# EAGLE design charger (EAGLE 6.5.0)
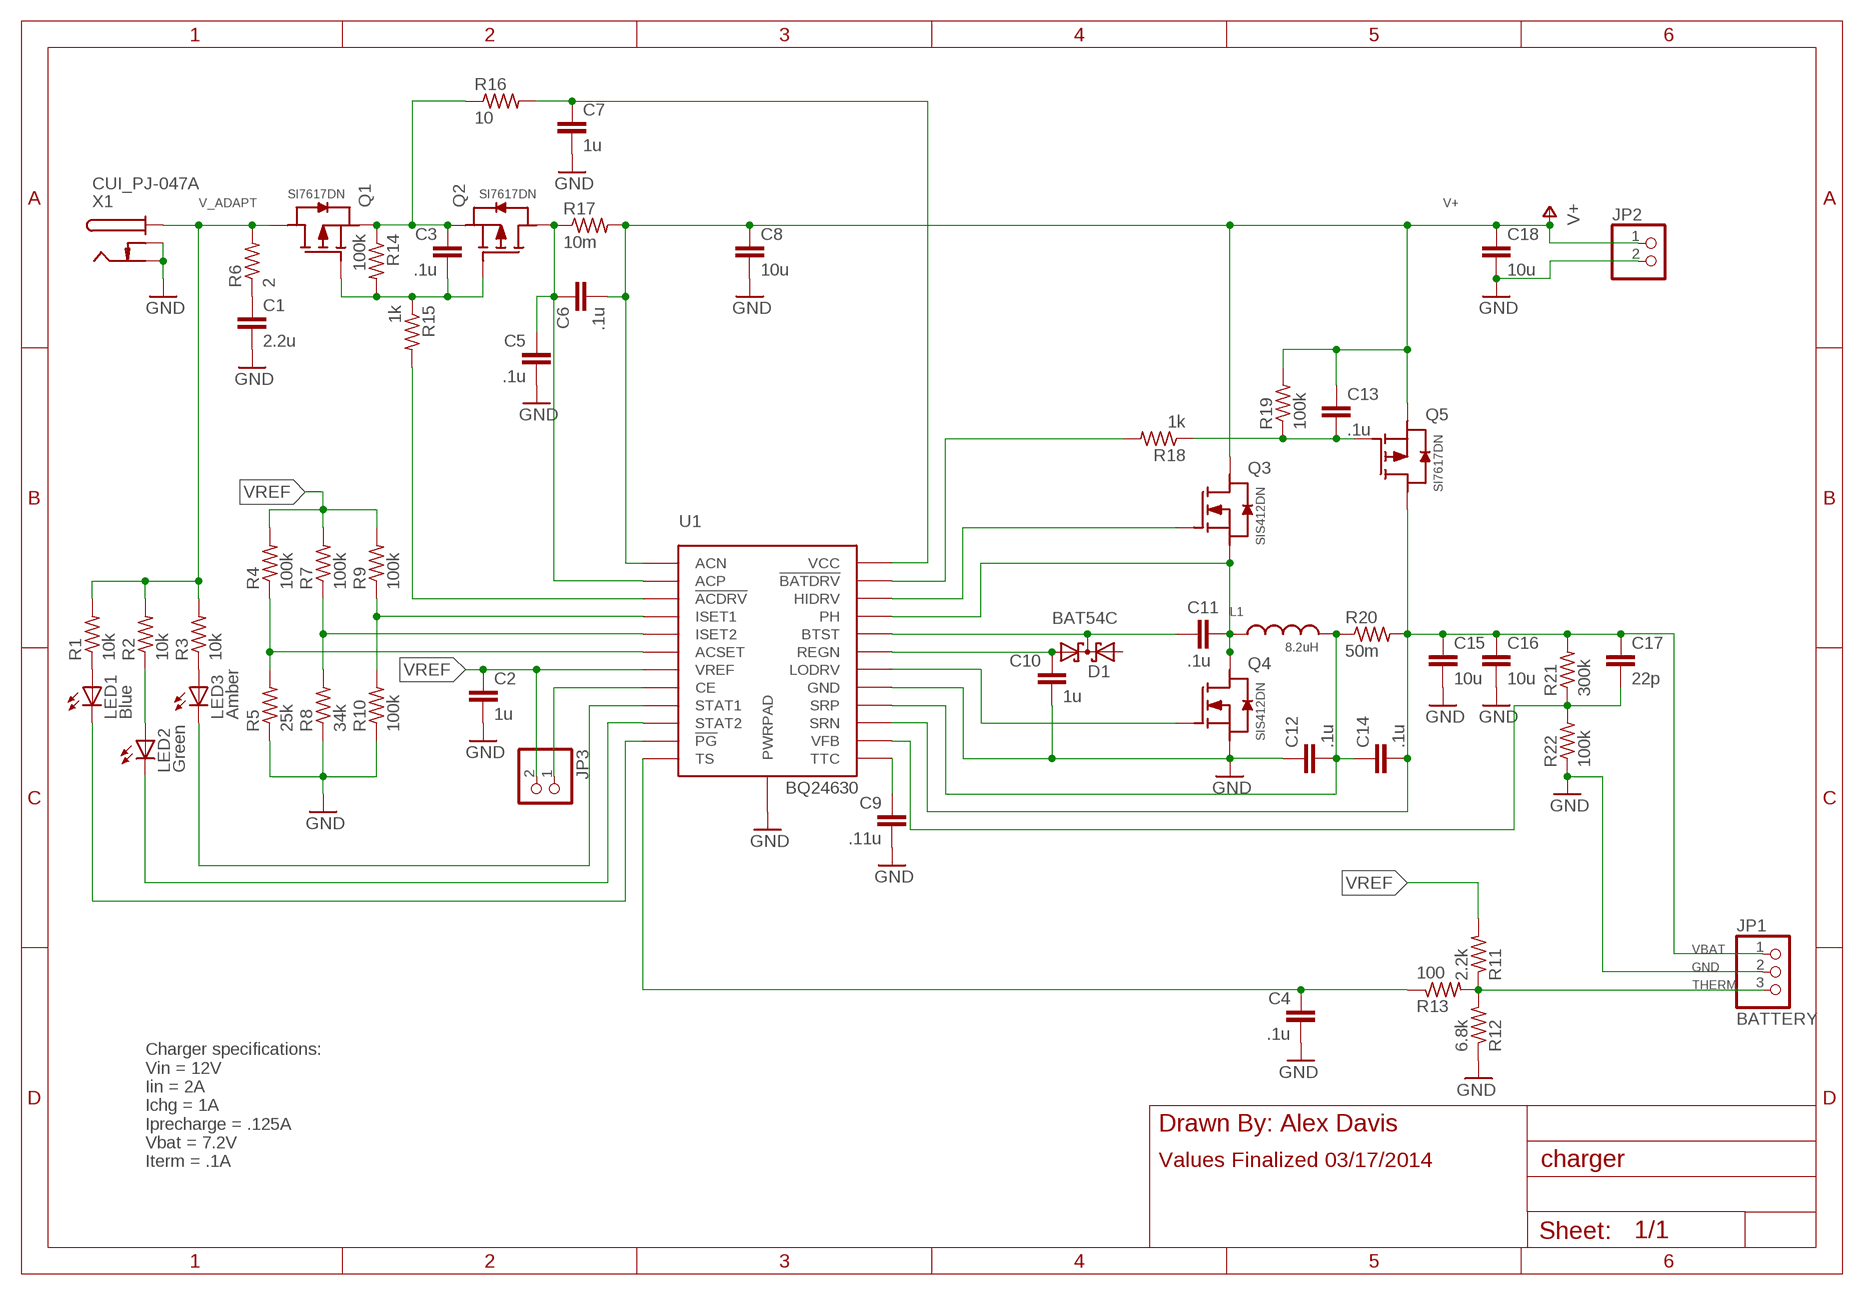
[diagram p0: schematic, sheet 1]

## Parts
C1  2.2u  C-EUC0603  [C0603]
C2  1u  C-EUC0603  [C0603]
C3  .1u  C-EUC0603  [C0603]
C4  .1u  C-EUC0603  [C0603]
C5  .1u  C-EUC0603  [C0603]
C6  .1u  C-EUC0603  [C0603]
C7  1u  C-EUC0603  [C0603]
C8  10u  C-EUC0805  [C0805]
C9  .11u  C-EUC0603  [C0603]
C10  1u  C-EUC0603  [C0603]
C11  .1u  C-EUC0603  [C0603]
C12  .1u  C-EUC0603  [C0603]
C13  .1u  C-EUC0603  [C0603]
C14  .1u  C-EUC0603  [C0603]
C15  10u  C-EUC0805  [C0805]
C16  10u  C-EUC0805  [C0805]
C17  22p  C-EUC0603  [C0603]
C18  10u  C-EUC0805  [C0805]
D1  BAT54C  [SOT23]
JP1  BATTERY  PINHD-1X3  [1X03]
JP2  PINHD-1X2  [1X02]
JP3  PINHD-1X2  [1X02]
L1  8.2uH  IHLP-2525CZ-01  [IHLP-2525CZ]
LED1  Blue  LEDCHIPLED_0805  [CHIPLED_0805]
LED2  Green  LEDCHIPLED_0805  [CHIPLED_0805]
LED3  Amber  LEDCHIPLED_0805  [CHIPLED_0805]
Q1  SI7617DN  [POWERPAK1212-8]
Q2  SI7617DN  [POWERPAK1212-8]
Q3  SIS412DN  [POWERPAK1212-8]
Q4  SIS412DN  [POWERPAK1212-8]
Q5  SI7617DN  [POWERPAK1212-8]
R1  10k  R-US_R0603  [R0603]
R2  10k  R-US_R0603  [R0603]
R3  10k  R-US_R0603  [R0603]
R4  100k  R-US_R0603  [R0603]
R5  25k  R-US_R0603  [R0603]
R6  2  R-US_R2512  [R2512]
R7  100k  R-US_R0603  [R0603]
R8  34k  R-US_R0603  [R0603]
R9  100k  R-US_R0603  [R0603]
R10  100k  R-US_R0603  [R0603]
R11  2.2k  R-US_R0603  [R0603]
R12  6.8k  R-US_R0603  [R0603]
R13  100  R-US_R0603  [R0603]
R14  100k  R-US_R0603  [R0603]
R15  1k  R-US_R0603  [R0603]
R16  10  R-US_R1206  [R1206]
R17  10m  R-US_R2010  [R2010]
R18  1k  R-US_R0603  [R0603]
R19  100k  R-US_R0603  [R0603]
R20  50m  R-US_R2010  [R2010]
R21  300k  R-US_R0603  [R0603]
R22  100k  R-US_R0603  [R0603]
U1  BQ24630  [PVQFN-24]
X1  CUI_PJ-047A  CON-PWR  [PJ-047A]

## Nets
!PG: LED1.C U1.P$8(!PG)
GND: C1.2 C2.2 C4.2 C5.2 C7.2 C8.2 C9.2 C10.2 C12.1 C15.2 C16.2 C18.2 JP1.2 JP2.2 Q4.P$1(S) Q4.P$2(S) Q4.P$3(S) R5.1 R8.1 R10.1 R12.1 R22.1 U1.P$17(GND) U1.P$25(PWRPAD) X1.2 X1.3
N$1: C3.1 Q1.P$1(S) Q1.P$2(S) Q1.P$3(S) Q2.P$1(S) Q2.P$2(S) Q2.P$3(S) R14.1 R16.1
N$3: C3.2 Q1.P$4(G) Q2.P$4(G) R14.2 R15.1
N$4: C10.1 D1.2(A2) U1.P$18(REGN)
N$5: C5.1 C6.1 Q2.P$5(D) Q2.P$6(D) Q2.P$7(D) Q2.P$8(D) Q2.P$9(D) R17.1 U1.P$2(ACP)
N$6: C12.2 C14.1 L1.P$2 R20.1 U1.P$14(SRP)
N$7: JP3.1 U1.P$4(CE)
N$8: C11.1 D1.3(CC) U1.P$22(BTST)
N$9: Q4.P$4(G) U1.P$19(LODRV)
N$10: Q3.P$4(G) U1.P$21(HIDRV)
N$11: C11.2 L1.P$1 Q3.P$1(S) Q3.P$2(S) Q3.P$3(S) Q4.P$5(D) Q4.P$6(D) Q4.P$7(D) Q4.P$8(D) Q4.P$9(D) U1.P$20(PH)
N$12: C1.1 R6.1
N$13: R4.1 R5.2 U1.P$16(ACSET)
N$14: R15.2 U1.P$3(!ACDRV)
N$16: R7.1 R8.2 U1.P$15(ISET2)
N$17: R9.1 R10.2 U1.P$11(ISET1)
N$18: LED1.A R1.1
N$19: LED2.A R2.1
N$20: LED3.A R3.1
N$26: C4.1 R13.1 U1.P$6(TS)
N$27: C9.1 U1.P$7(TTC)
N$29: C17.2 R21.1 R22.2 U1.P$12(VFB)
N$30: R18.2 U1.P$23(!BATDRV)
N$33: C13.2 Q5.P$4(G) R18.1 R19.1
STAT1: LED3.C U1.P$5(STAT1)
STAT2: LED2.C U1.P$9(STAT2)
THERM: JP1.3 R11.1 R12.2 R13.2
V+: C6.2 C8.1 C13.1 C18.1 JP2.1 Q3.P$5(D) Q3.P$6(D) Q3.P$7(D) Q3.P$8(D) Q3.P$9(D) Q5.P$1(S) Q5.P$2(S) Q5.P$3(S) R17.2 R19.2 U1.P$1(ACN)
V_ADAPT: Q1.P$5(D) Q1.P$6(D) Q1.P$7(D) Q1.P$8(D) Q1.P$9(D) R1.2 R2.2 R3.2 R6.2 X1.1
VBAT: C14.2 C15.1 C16.1 C17.1 JP1.1 Q5.P$5(D) Q5.P$6(D) Q5.P$7(D) Q5.P$8(D) Q5.P$9(D) R20.2 R21.2 U1.P$13(SRN)
VCC: C7.1 R16.2 U1.P$24(VCC)
VREF: C2.1 JP3.2 R4.2 R7.2 R9.2 R11.2 U1.P$10(VREF)
Unconnected: D1.1(A1)

## Notes on the sheet
- Drawn By: Alex Davis
- Charger specifications: 
  Vin = 12V
  Iin = 2A
  Ichg = 1A
  Iprecharge = .125A
  Vbat = 7.2V
  Iterm = .1A
- Values Finalized 03/17/2014

## Library data of the parts
C1-C18 = rcl:C-EU: CAPACITOR, European symbol
D1 = diode:BAT54C: Schottky Diodes Source: Fairchild .. BAT54.pdf
JP1 = pinhead:PINHD-1X3: PIN HEADER
JP2 JP3 = pinhead:PINHD-1X2: PIN HEADER
L1 = alex:IHLP-2525CZ-01
LED1-LED3 = led:LED: LED OSRAM: - CHIPLED LG R971, LG N971, LY N971, LG Q971, LY Q971, LO R971, LY R971 LH N974, LH R974 LS Q976, LO Q976, LY Q976 LO Q996 - Hyper CHIPLED LW Q18S LB Q993, LB Q99A, LB R99A - SideLED LS A670, LO A670, LY A670, LG A670, LP A670 LB A673, LV A673, LT A673, LW A673 LH A674 LY A675 LS A676, LA A676, LO A676, LY A676, LW A676 LS A679, LY A679, LG A679 - Hyper Micro SIDELED® LS Y876, LA Y876, LO Y876, LY Y876 LT Y87S - SmartLED LW L88C, LW L88S LB L89C, LB L89S, LG L890 LS L89K, LO L89K, LY L89K LS L896, LA L896, LO L896, LY L896 - TOPLED LS T670, LO T670, LY T670, LG T670, LP T670 LSG T670, LSP T670, LSY T670, LOP T670, LYG T670 LG T671, LOG T671, LSG T671 LB T673, LV T673, LT T673, LW T673 LH T674 LS T676, LA T676, LO T676, LY T676, LB T676, LH T676, LSB T676, LW T676 LB T67C, LV T67C, LT T67C, LS T67K, LO T67K, LY T67K, LW E67C LS E67B, LA E67B, LO E67B, LY E67B, LB E67C, LV E67C, LT E67C LW T67C LS T679, LY T679, LG T679 LS T770, LO T770, LY T770, LG T770, LP T770 LB T773, LV T773, LT T773, LW T773 LH T774 LS E675, LA E675, LY E675, LS T675 LS T776, LA T776, LO T776, LY T776, LB T776 LHGB T686 LT T68C, LB T68C - Hyper Mini TOPLED® LB M676 - Mini TOPLED Santana® LG M470 LS M47K, LO M47K, LY M47K Source: http://www.osram.convergy.de LUXEON: - LUMILED® LXK2-PW12-R00, LXK2-PW12-S00, LXK2-PW14-U00, LXK2-PW14-V00 LXK2-PM12-R00, LXK2-PM12-S00, LXK2-PM14-U00 LXK2-PE12-Q00, LXK2-PE12-R00, LXK2-PE12-S00, LXK2-PE14-T00, LXK2-PE14-U00 LXK2-PB12-K00, LXK2-PB12-L00, LXK2-PB12-M00, LXK2-PB14-N00, LXK2-PB14-P00, LXK2-PB14-Q00 LXK2-PR12-L00, LXK2-PR12-M00, LXK2-PR14-Q00, LXK2-PR14-R00 LXK2-PD12-Q00, LXK2-PD12-R00, LXK2-PD12-S00 LXK2-PH12-R00, LXK2-PH12-S00 LXK2-PL12-P00, LXK2-PL12-Q00, LXK2-PL12-R00 Source: www.luxeon.com KINGBRIGHT: KA-3528ASYC Source: www.kingbright.com
Q1 Q2 Q5 = alex:SI7617DN
Q3 Q4 = alex:SIS412DN
R1-R22 = rcl:R-US_: RESISTOR, American symbol
U1 = alex:BQ24630
X1 = alex:CON-PWR

## Board
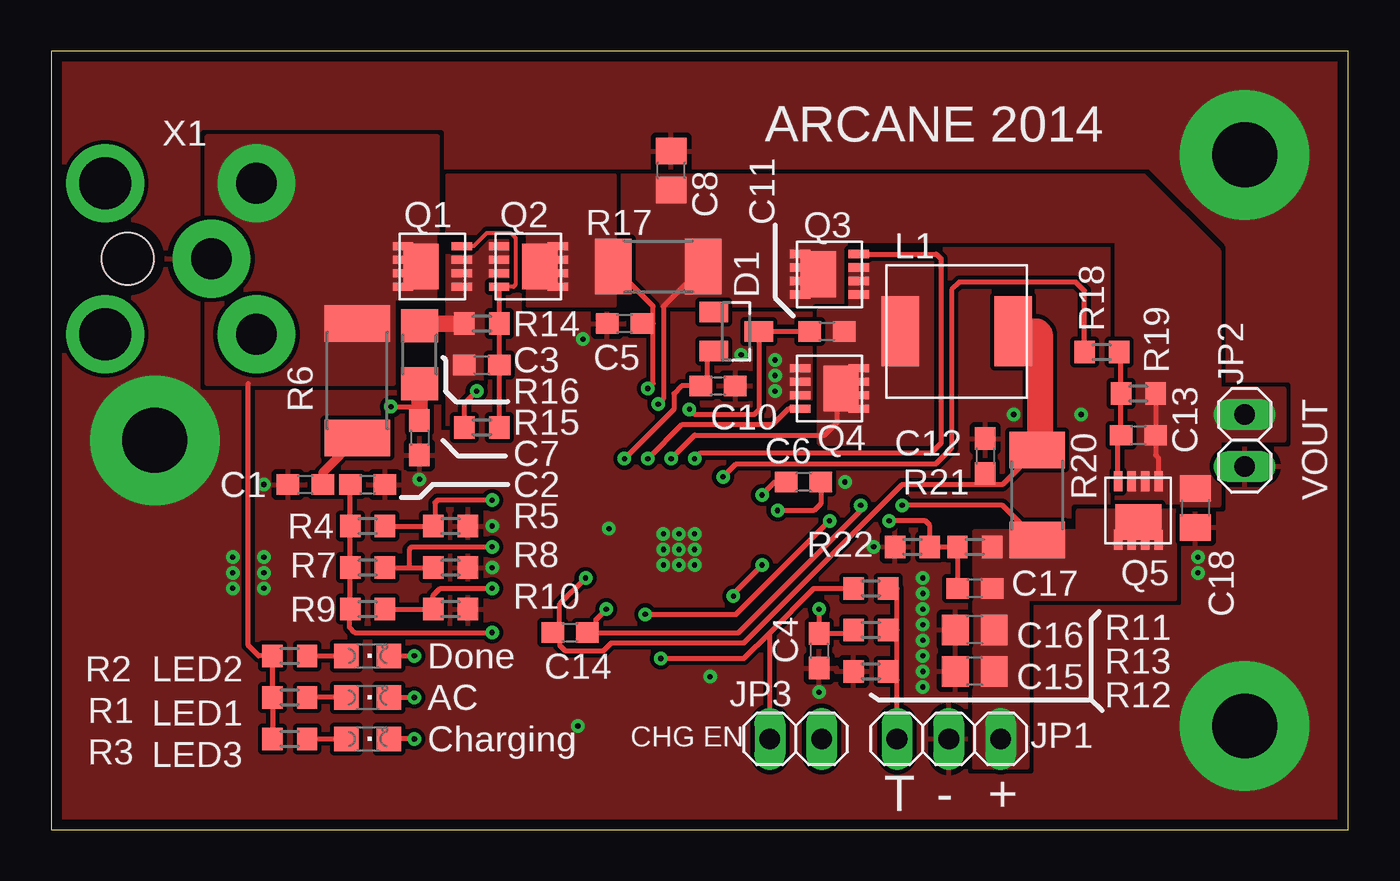
[diagram p1: board, top side]
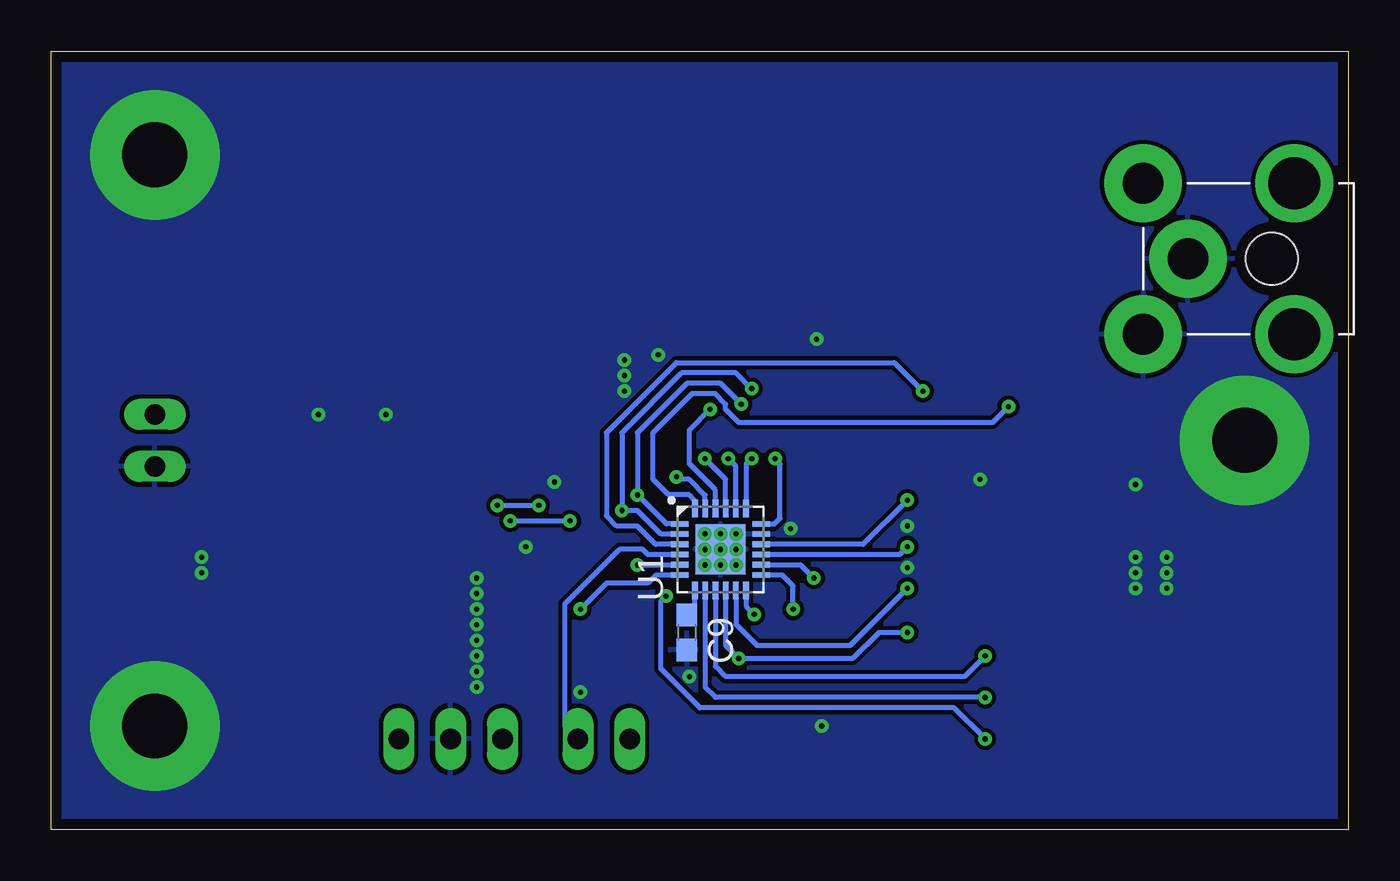
[diagram p2: board, bottom side, seen from below]

Size 63.5 x 38.1 mm. Coordinates in mm from the lower left corner, seen from the top.
Outline: 0,0 63.5,0 63.5,38.1 0,38.1 0,0
Copper layers (1*16): Top 0.035mm / dielectric 0.5mm / Bottom 0.035mm
Design rules "default *": minimum track width 8mil, minimum drill 10mil, track to track 8mil, track to pad 8mil, pad to pad 8mil, via to via 8mil, smd to smd 8mil, copper to edge 20mil, drill to drill 8mil, minimum pad ring 10mil, minimum via ring 8mil, stop-mask expansion 4mil, vias tented up to drill 12mil, thermal gap 10mil

### Footprints (pad centres in the part's own frame; a part is rotated, then mirrored left to right if it is on the bottom)
C0603 = smd 1.1 x 1: 1 -0.85,0; 2 0.85,0
C0805 = smd 1.3 x 1.5: 1 -0.95,0; 2 0.95,0
SOT23 = smd 1 x 1.4: 1 -0.95,-1.1; 2 0.95,-1.1; 3 0,1.1
1X03 = drill 1.016 long: 1 -2.54,0; 2 0,0; 3 2.54,0
1X02 = drill 1.016 long: 1 -1.27,0; 2 1.27,0
IHLP-2525CZ = smd 1.829 x 3.429: P$1 -2.769,0; P$2 2.769,0
CHIPLED_0805 = smd 1.2 x 1.2: A 0,-1.05; C 0,1.05
POWERPAK1212-8 = smd 0.991 x 0.406: P$1 -1.435,0.991; P$2 -1.435,0.33; P$3 -1.435,-0.33; P$4 -1.435,-0.991; P$5 1.435,-0.991; P$6 1.435,-0.33; P$7 1.435,0.33; P$8 1.435,0.991 | smd 1.727 x 2.235: P$9 0.559,0
R0603 = smd 1 x 1.1: 1 -0.85,0; 2 0.85,0
R2512 = smd 1.8 x 3.2: 1 -2.8,0; 2 2.8,0
R1206 = smd 1.6 x 1.803: 1 -1.422,0; 2 1.422,0
R2010 = smd 1.8 x 2.7: 1 -2.2,0; 2 2.2,0
PVQFN-24 = smd 0.85 x 0.28: P$1 -2,1.25; P$2 -2,0.75; P$3 -2,0.25; P$4 -2,-0.25; P$5 -2,-0.75; P$6 -2,-1.25; P$13 2,-1.25; P$14 2,-0.75; P$15 2,-0.25; P$16 2,0.25; P$17 2,0.75; P$18 2,1.25 | smd 0.28 x 0.85: P$7 -1.25,-2; P$8 -0.75,-2; P$9 -0.25,-2; P$10 0.25,-2; P$11 0.75,-2; P$12 1.25,-2; P$19 1.25,2; P$20 0.75,2; P$21 0.25,2; P$22 -0.25,2; P$23 -0.75,2; P$24 -1.25,2 | smd 2.45 x 2.45: P$25 0,0
PJ-047A = drill 2 pad 3.81: 1 3.7,-3.7; 2 1.5,0; 3 3.7,3.7 | drill 2.54 pad 3.81: MNT1 -3.7,3.7; MNT2 -3.7,-3.7 | hole 2.54: -2.6,0

### Placement (x,y rotation side)
C1  12.45,16.89 180 top
C2  15.49,16.89 0 top
C3  21.08,22.73 0 top
C4  37.59,8.76 270 top
C5  28.07,24.77 180 top
C6  36.83,17.02 180 top
C7  18.03,19.18 270 top
C8  30.35,32.26 90 top
C9  32.38,9.65 270 bottom
C10  32.64,21.72 0 top
C11  37.97,24.38 0 top
C12  45.72,18.29 270 top
C13  53.21,19.3 180 top
C14  25.4,9.65 0 top
C15  45.21,7.75 180 top
C16  45.21,9.78 180 top
C17  45.21,11.81 180 top
C18  56.01,15.75 270 top
D1  33.53,24.38 270 top
JP1  43.94,4.45 180 top
JP2  58.42,19.05 270 top
JP3  36.45,4.45 180 top
L1  44.32,24.38 0 top
LED1  15.49,6.48 270 top
LED2  15.49,8.51 270 top
LED3  15.49,4.45 270 top
Q1  18.67,27.56 180 top
Q2  23.37,27.56 0 top
Q3  38.1,27.18 180 top
Q4  38.1,21.59 0 top
Q5  53.21,15.62 270 top
R1  11.68,6.48 180 top
R2  11.68,8.51 180 top
R3  11.68,4.45 180 top
R4  15.49,14.86 180 top
R5  19.56,14.86 180 top
R6  14.99,21.97 90 top
R7  15.49,12.83 180 top
R8  19.56,12.83 180 top
R9  15.49,10.79 180 top
R10  19.56,10.79 180 top
R11  40.13,11.81 180 top
R12  40.13,7.75 0 top
R13  40.13,9.78 0 top
R14  21.08,24.77 0 top
R15  21.08,19.68 180 top
R16  18.03,23.24 270 top
R17  29.72,27.56 0 top
R18  51.44,23.37 180 top
R19  53.21,21.34 0 top
R20  48.26,16.38 270 top
R21  45.21,13.84 0 top
R22  42.16,13.84 0 top
U1  30.73,13.72 0 bottom
X1  6.35,27.94 180 bottom

### Tracks (layer width: path | path; a pad name or v marks a point on that pad's centre or on a via)
!PG  (via drill 0.25)
  Top 0.254: LED1.C v17.78,6.48
  Bottom 0.254: v17.78,6.48 30.99,6.48 31.48,6.97 U1.P$8
GND  (via drill 0.25, 3.17 pad 6.35)
  other vias: 42.67,12.32 42.67,11.56 42.67,10.79 42.67,10.03 42.67,9.27 42.67,8.51 42.67,7.75 42.67,6.99 26.04,24 18.03,17.14 10.41,16.89 56.13,13.34 56.13,12.57 37.59,6.73 40.26,13.84 47.12,20.32 35.43,22.23 35.43,22.99 35.43,21.46 33.78,23.24 30.73,13.72 30.73,14.48 30.73,12.95 31.5,13.72 29.97,13.72 29.97,14.48 31.5,14.48 31.5,12.95 29.97,12.95 21.59,14.86 21.59,12.83 32.26,7.49 50.42,20.32 27.3,14.73 25.78,5.08 38.86,17.02 10.41,13.34 10.41,12.57 10.41,11.81 8.89,11.81 8.89,12.57 8.89,13.34 5.08,19.05 58.42,5.08 58.42,33.02
  pour Top (rank 3): 0,38.1 63.5,38.1 63.5,0 0,0
  pour Bottom (rank 3): 0,38.1 63.5,38.1 63.5,0 0,0
  pour Top (rank 3, no thermals): 37.21,23.37 35.31,23.37 35.31,19.94 37.21,19.94
N$1
  Top 0.254: R16.1 18.16,24.66 18.26,24.77
  Top 0.813: 18.26,24.77 R14.1
  pour Top (rank 2, no thermals): 19.43,29.21 22.73,29.21 22.73,19.81 19.43,19.81
N$3
  Top 0.203: 20.13,28.57 20.7,28.57 21.34,29.21 22.48,29.21 22.73,28.96 22.73,26.67 22.63,26.57 Q2.P$4
  Top 0.254: R15.1 C3.2 R14.2 Q2.P$4 21.96,26.54 | Q1.P$4 20.13,28.57
N$4  (via drill 0.25)
  Top 0.254: D1.2 32.13,23.14 32.13,21.97 31.88,21.72 C10.1 30.86,21.72 30.48,21.34 30.48,20.57 v28.07,18.16
  Bottom 0.254: U1.P$18 28.09,14.97 27.81,15.24 27.81,17.91 v28.07,18.16
N$5  (via drill 0.25)
  Top 0.254: R17.1 29.46,25.61 29.46,24.77 | v29.21,21.59 29.46,21.84 29.46,24.77 | C5.1 29.46,24.77 | C6.1 37.68,15.96 37.34,15.62 v35.56,15.62
  Bottom 0.254: v29.21,21.59 29.97,22.35 32.64,22.35 35.56,19.43 v35.56,15.62 34.8,15.62 33.64,14.47 U1.P$2
  pour Top (no thermals): 23.37,25.65 23.37,29.21 19.43,29.21 19.43,32 27.56,32 27.56,25.65
N$6  (via drill 0.25)
  Top 0.254: R20.1 46.57,16.89 45.72,16.89 | 45.72,16.89 41.66,16.89 33.91,9.14 27.43,9.14 27.05,8.76 25.15,8.76 24.89,9.02 24.89,9.65 | C12.2 45.72,16.89 | v26.16,12.32 24.89,11.05 24.89,9.65 | C14.1 24.89,9.65
  Top 1.27: L1.P$2 48.26,24.38 48.39,24.26 48.39,18.71 R20.1
  Bottom 0.254: U1.P$14 26.81,12.97 v26.16,12.32
N$7
  Bottom 0.254: JP3.1 38.35,5.08 38.35,11.05 35.69,13.72 34.54,13.72 34.29,13.47 U1.P$4
N$8  (via drill 0.25)
  Top 0.254: C11.1 D1.3 34.67,24.34 34.67,20.57 34.42,20.32 31.5,20.32 v31.24,20.57
  Bottom 0.254: U1.P$22 30.98,16.63 32.26,17.91 32.26,19.56 v31.24,20.57
N$9  (via drill 0.25)
  Top 0.254: Q4.P$4 36.09,20.6 35.31,19.81 30.86,19.81 v29.21,18.16
  Bottom 0.254: v29.21,18.16 29.48,17.89 U1.P$19
N$10  (via drill 0.25)
  Top 0.254: Q3.P$4 43.33,28.17 43.56,27.94 43.56,18.92 43.05,18.41 31.75,18.41 v31.5,18.16
  Bottom 0.254: U1.P$21 30.48,17.15 v31.5,18.16
N$11  (via drill 0.25)
  Top 0.254: Q4.P$8 38.66,21.7 Q4.P$9 38.48,21.41 38.48,19.94 37.85,19.3 31.5,19.3 v30.35,18.16
  Bottom 0.254: U1.P$20 29.98,17.79 v30.35,18.16
  pour Top (no thermals): 39.12,28.57 39.12,25.4 37.59,25.4 37.59,18.92 43.31,18.92 43.31,28.57
N$12
  Top 0.406: C1.1 13.3,17.48 R6.1
N$13  (via drill 0.25)
  Top 0.254: R4.1 R5.2 18.8,14.95 18.8,16 18.92,16.13 v21.59,16.13
  Bottom 0.254: v21.59,16.13 23.75,13.97 U1.P$16
N$14  (via drill 0.25)
  Top 0.254: 20.23,19.77 R15.2 20.23,20.87 v20.83,21.46
  Bottom 0.254: v20.83,21.46 22.23,22.86 32.89,22.86 36.32,19.43 36.32,15.37 35.81,14.86 34.8,14.86 33.91,13.97 U1.P$3
N$16  (via drill 0.25)
  Top 0.254: R7.1 17.53,12.83 | 17.53,12.83 R8.2 | 17.53,12.83 17.53,13.72 17.65,13.84 v21.59,13.84
  Bottom 0.254: v21.59,13.84 21.97,13.47 U1.P$15
N$17  (via drill 0.25)
  Top 0.254: R9.1 R10.2 18.71,11.47 19.05,11.81 v21.59,11.81
  Bottom 0.254: v21.59,11.81 24.38,9.02 28.96,9.02 29.98,10.04 U1.P$11
N$18
  Top 0.254: LED1.A R1.1
N$19
  Top 0.254: R2.1 LED2.A
N$20
  Top 0.254: R3.1 LED3.A
N$26  (via drill 0.25)
  Top 0.254: R13.1 39.12,9.61 C4.1 v37.59,10.79
  Bottom 0.254: v37.59,10.79 36.32,12.06 34.29,12.06 33.89,12.47 U1.P$6
N$27
  Bottom 0.254: 32.4,10.51 C9.1 31.98,10.9 U1.P$7
N$29  (via drill 0.25)
  Top 0.254: C17.2 R21.1 R22.2 43.01,14.9 42.8,15.11 v41.02,15.11 | v29.08,10.54 33.53,10.54 v38.1,15.11
  Bottom 0.254: v41.02,15.11 v38.1,15.11 | U1.P$12 29.48,10.94 v29.08,10.54
N$30  (via drill 0.25)
  Top 0.254: R18.2 50.59,26.38 50.16,26.8 44.45,26.8 44.07,26.42 44.07,18.67 43.31,17.91 33.53,17.91 v32.89,17.27
  Bottom 0.254: U1.P$23 31.48,16.37 32.26,17.14 32.77,17.14 v32.89,17.27
N$33
  Top 0.254: Q5.P$4 52.22,19.16 C13.2 R19.1 52.36,23.29 R18.1
STAT1  (via drill 0.25)
  Top 0.254: v17.78,4.45 LED3.C | v33.4,11.43 33.4,11.56 v34.8,12.95
  Bottom 0.254: v17.78,4.45 19.3,5.97 31.75,5.97 33.66,7.87 33.66,11.18 v33.4,11.43 | v34.8,12.95 34.79,12.97 U1.P$5
STAT2  (via drill 0.25)
  Top 0.254: LED2.C v17.78,8.51
  Bottom 0.254: v17.78,8.51 18.8,7.49 30.48,7.49 30.98,8 U1.P$9
THERM
  Top 0.254: JP1.3 41.4,7.33 | 41.4,7.33 R12.2 | 41.4,7.33 41.4,9.78 | 41.4,9.78 41.4,11.81 R11.1 | R13.2 41.4,9.78
V+  (via drill 0.25)
  Top 0.254: Q3.P$5 37.54,27.29 Q3.P$9 | Q3.P$6 36.99,27.18 | Q3.P$7 36.99,27.18 | 36.99,27.18 Q3.P$9 | Q3.P$8 37.54,27.06 Q3.P$9 | R19.2 C13.1 54.06,18.33 54.2,18.19 Q5.P$1 | R17.2 29.97,25.61 29.97,21.08 v29.72,20.83 | C6.2 35.43,17.02 v34.8,16.38
  Bottom 0.254: v29.72,20.83 30.73,21.84 32.38,21.84 34.8,19.43 v34.8,16.38 33.38,14.97 U1.P$1
  pour Top (rank 2, no thermals): 27.81,32 53.47,32 57.15,28.32 57.15,21.59 60.33,21.59 60.33,19.05 57.15,19.05 57.15,15.88 52.2,15.88 52.2,28.83 38.86,28.83 38.86,25.65 27.81,25.65
V_ADAPT
  Top 0.254: R3.2 R1.2 R2.2 10.16,8.51 9.65,9.02 9.65,21.84
  pour Top (no thermals): 7.62,21.84 16.76,21.84 16.76,26.04 18.8,26.04 18.8,29.34 18.92,29.34 18.92,33.91 7.62,33.91
VBAT  (via drill 0.25)
  Top 0.254: R20.2 46.57,15.88 v41.66,15.88 | Q5.P$8 53.33,15.06 Q5.P$9 | Q5.P$7 53.21,14.52 | Q5.P$6 53.21,14.52 | 53.21,14.52 53.21,14.99 | 53.21,14.99 Q5.P$9 | Q5.P$9 53.1,15.06 Q5.P$5 53.15,15.11 53.21,15.11 53.09,14.99 53.21,14.99 | v39.62,15.88 39.62,15.62 33.66,9.65 26.67,9.65 | C14.2 26.67,9.65 | 26.67,9.65 26.67,10.29 v27.18,10.79
  Bottom 0.254: v41.66,15.88 v39.62,15.88 | v27.18,10.79 27.18,11.94 27.71,12.47 U1.P$13
  pour Top (no thermals): 54.99,15.62 54.99,11.3 47.75,11.3 47.75,3.05 45.21,3.05 45.21,14.61 50.29,14.61 50.29,15.62
VCC  (via drill 0.25)
  Top 0.254: v16.64,20.7 18.03,20.7
  Top 0.813: C7.1 18.03,20.7 R16.2
  Bottom 0.254: v16.64,20.7 17.4,19.94 29.84,19.94 30.48,20.57 30.48,20.83 30.99,21.34 32.13,21.34 34.04,19.43 34.04,17.14 33.27,16.38 32.26,16.38 31.98,16.11 U1.P$24
VREF  (via drill 0.25)
  Top 0.254: C2.1 R4.2 R7.2 R9.2 14.61,10.76 14.61,9.91 14.86,9.65 v21.59,9.65 | R11.2 37.34,11.81 35.18,9.65 | 35.18,9.65 33.91,8.38 v29.84,8.38 | JP3.2 35.18,9.65
  Bottom 0.254: U1.P$10 30.48,9.02 v29.84,8.38 24.26,8.38 22.99,9.65 v21.59,9.65

### Text on the board
tPlace: ARCANE 2014
tNames: VOUT | Done | AC | CHG EN | Charging | T | - | +
Measures: Cutout for power connector / to be ~.35" wide, ~.35" tall | .2" clearance above board required. | All dimensions in inches unless otherwise noted
Reference: 2S LiFePO4
tDocu: JP1 and 3 should be / right-angle type headers / mounted to the bottom / of the board rather than / the vertical headers in the / design